# Altium schematic sheet Sheet11.SchDoc
size A4
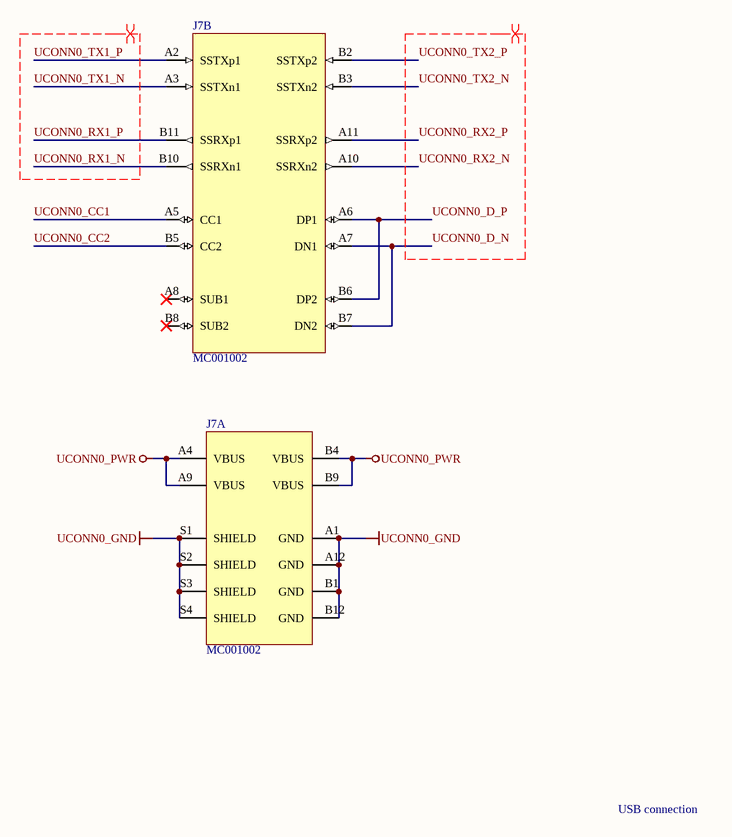
[diagram p0: Sheet11.SchDoc]

## Parts
J7  MC001002  [MC001002]  (parts A,B of 2)

## Nets
UCONN0_GND: J7.A1(GND) J7.A12(GND) J7.B1(GND) J7.B12(GND) J7.S1(SHIELD) J7.S2(SHIELD) J7.S3(SHIELD) J7.S4(SHIELD)
UCONN0_PWR: J7.A4(VBUS) J7.A9(VBUS) J7.B4(VBUS) J7.B9(VBUS)
UCONN0_CC1: J7.A5(CC1)
UCONN0_CC2: J7.B5(CC2)
UCONN0_D_N: J7.A7(DN1) J7.B7(DN2)
UCONN0_D_P: J7.A6(DP1) J7.B6(DP2)
UCONN0_RX1_N: J7.B10(SSRXn1)
UCONN0_RX1_P: J7.B11(SSRXp1)
UCONN0_RX2_N: J7.A10(SSRXn2)
UCONN0_RX2_P: J7.A11(SSRXp2)
UCONN0_TX1_N: J7.A3(SSTXn1)
UCONN0_TX1_P: J7.A2(SSTXp1)
UCONN0_TX2_N: J7.B3(SSTXn2)
UCONN0_TX2_P: J7.B2(SSTXp2)

Not connected (* = marked no-connect by the designer): J7 A8(SUB1)* B8(SUB2)*

## Layout directives
differential pair: UCONN0_D_N, UCONN0_D_P, UCONN0_RX1_N, UCONN0_RX1_P, UCONN0_RX2_N, UCONN0_RX2_P, UCONN0_TX1_N, UCONN0_TX1_P, UCONN0_TX2_N, UCONN0_TX2_P

## Notes on the sheet
- USB connection

## Library data of the parts
J7 = MC001002: USB C Female SMT Connector